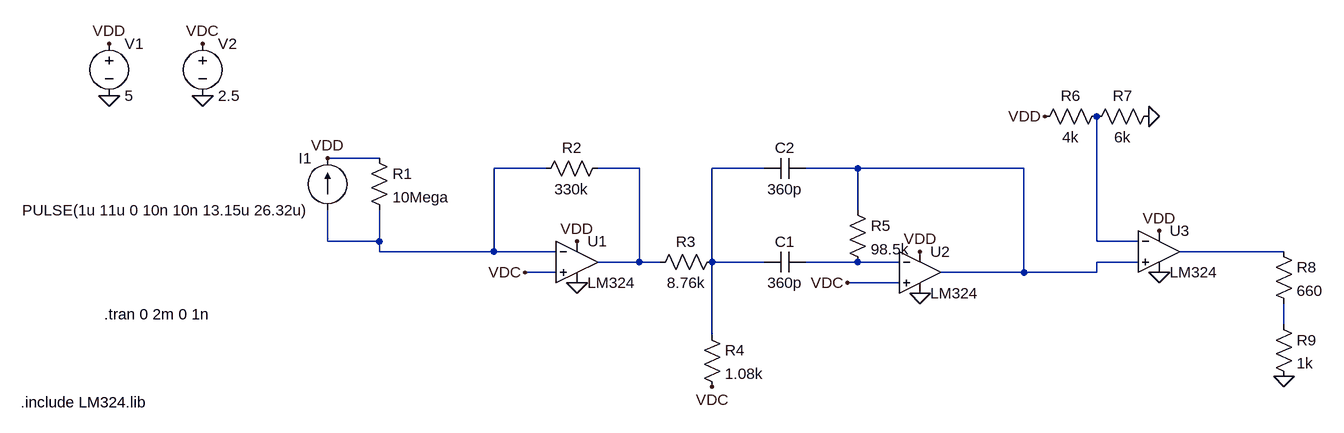
[diagram p0: schematic receiver-chain-38khz-transient.asc]
receiver-chain-38khz-transient.asc, the LTspice schematic file:
Version 4.1
SHEET 1 1492 680
WIRE -304 -336 -384 -336
WIRE -48 -320 -128 -320
WIRE 96 -320 32 -320
WIRE 288 -320 208 -320
WIRE 432 -320 352 -320
WIRE 688 -320 432 -320
WIRE 432 -256 432 -320
WIRE -384 -208 -384 -256
WIRE -304 -208 -304 -256
WIRE -304 -208 -384 -208
WIRE 800 -208 800 -400
WIRE 864 -208 800 -208
WIRE -304 -192 -304 -208
WIRE -128 -192 -128 -320
WIRE -128 -192 -304 -192
WIRE -32 -192 -128 -192
WIRE 1088 -192 928 -192
WIRE 96 -176 96 -320
WIRE 96 -176 32 -176
WIRE 128 -176 96 -176
WIRE 208 -176 208 -320
WIRE 288 -176 208 -176
WIRE 432 -176 352 -176
WIRE 496 -176 432 -176
WIRE 864 -176 800 -176
WIRE -32 -160 -80 -160
WIRE 688 -160 688 -320
WIRE 688 -160 560 -160
WIRE 800 -160 800 -176
WIRE 800 -160 688 -160
WIRE 496 -144 416 -144
WIRE 1088 -80 1088 -112
WIRE 208 -64 208 -176
FLAG -720 -432 0
FLAG -720 -512 VDD
FLAG -384 -336 VDD
FLAG 0 -208 VDD
FLAG 0 -144 0
FLAG 416 -144 VDC
FLAG 208 16 VDC
FLAG 880 -400 0
FLAG 720 -400 VDD
FLAG 896 -224 VDD
FLAG 528 -192 VDD
FLAG 528 -128 0
FLAG 896 -160 0
FLAG -576 -512 VDC
FLAG -576 -432 0
FLAG 1088 0 0
FLAG -80 -160 VDC
SYMBOL voltage -720 -528 R0
WINDOW 123 0 0 Left 0
WINDOW 39 0 0 Left 0
SYMATTR InstName V1
SYMATTR Value 5
SYMBOL current -384 -256 R180
WINDOW 0 24 80 Left 2
WINDOW 3 24 0 Left 2
WINDOW 123 24 52 Left 2
WINDOW 39 0 0 Left 0
SYMATTR InstName I1
SYMATTR Value PULSE(1u 11u 0 10n 10n 13.15u 26.32u)
SYMBOL res -320 -352 R0
SYMATTR InstName R1
SYMATTR Value 10Mega
SYMBOL res 48 -336 R90
WINDOW 0 0 56 VBottom 2
WINDOW 3 32 56 VTop 2
SYMATTR InstName R2
SYMATTR Value 330k
SYMBOL res 224 -192 R90
WINDOW 0 0 56 VBottom 2
WINDOW 3 32 56 VTop 2
SYMATTR InstName R3
SYMATTR Value 8.76k
SYMBOL res 192 -80 R0
SYMATTR InstName R4
SYMATTR Value 1.08k
SYMBOL cap 352 -192 R90
WINDOW 0 0 32 VBottom 2
WINDOW 3 32 32 VTop 2
SYMATTR InstName C1
SYMATTR Value 360p
SYMBOL res 416 -272 R0
SYMATTR InstName R5
SYMATTR Value 98.5k
SYMBOL cap 352 -336 R90
WINDOW 0 0 32 VBottom 2
WINDOW 3 32 32 VTop 2
SYMATTR InstName C2
SYMATTR Value 360p
SYMBOL res 816 -416 R90
WINDOW 0 0 56 VBottom 2
WINDOW 3 32 56 VTop 2
SYMATTR InstName R6
SYMATTR Value 4k
SYMBOL res 896 -416 R90
WINDOW 0 0 56 VBottom 2
WINDOW 3 32 56 VTop 2
SYMATTR InstName R7
SYMATTR Value 6k
SYMBOL voltage -576 -528 R0
SYMATTR InstName V2
SYMATTR Value 2.5
SYMBOL res 1072 -208 R0
SYMATTR InstName R8
SYMATTR Value 660
SYMBOL res 1072 -96 R0
SYMATTR InstName R9
SYMATTR Value 1k
SYMBOL sym\\OpAmps\\opamp2 0 -240 R0
SYMATTR InstName U1
SYMATTR Value LM324
SYMATTR SpiceModel LM324
SYMBOL sym\\OpAmps\\opamp2 528 -224 R0
SYMATTR InstName U2
SYMATTR Value LM324
SYMATTR SpiceModel LM324
SYMBOL sym\\OpAmps\\opamp2 896 -256 R0
SYMATTR InstName U3
SYMATTR Value LM324
SYMATTR SpiceModel LM324
TEXT -856 40 Left 2 !.include LM324.lib
TEXT -728 -96 Left 2 !.tran 0 2m 0 1n

The netlist it stands for:
* receiver-chain-38khz-transient.asc
V1 VDD 0 5
I1 N001 VDD PULSE(1u 11u 0 10n 10n 13.15u 26.32u)
R1 VDD N001 10Mega
R2 N002 N001 330k
R3 N003 N002 8.76k
R4 N003 VDC 1.08k
C1 N007 N003 360p
R5 N004 N007 98.5k
C2 N004 N003 360p
R6 N005 VDD 4k
R7 0 N005 6k
V2 VDC 0 2.5
R8 N006 N008 660
R9 N008 0 1k
X§U1 VDC N001 VDD 0 N002 LM324 LM324  ; pins In+ In- V+ V- OUT
X§U2 VDC N007 VDD 0 N004 LM324 LM324  ; pins In+ In- V+ V- OUT
X§U3 N004 N005 VDD 0 N006 LM324 LM324  ; pins In+ In- V+ V- OUT
.include LM324.lib
.tran 0 2m 0 1n
.backanno
.end